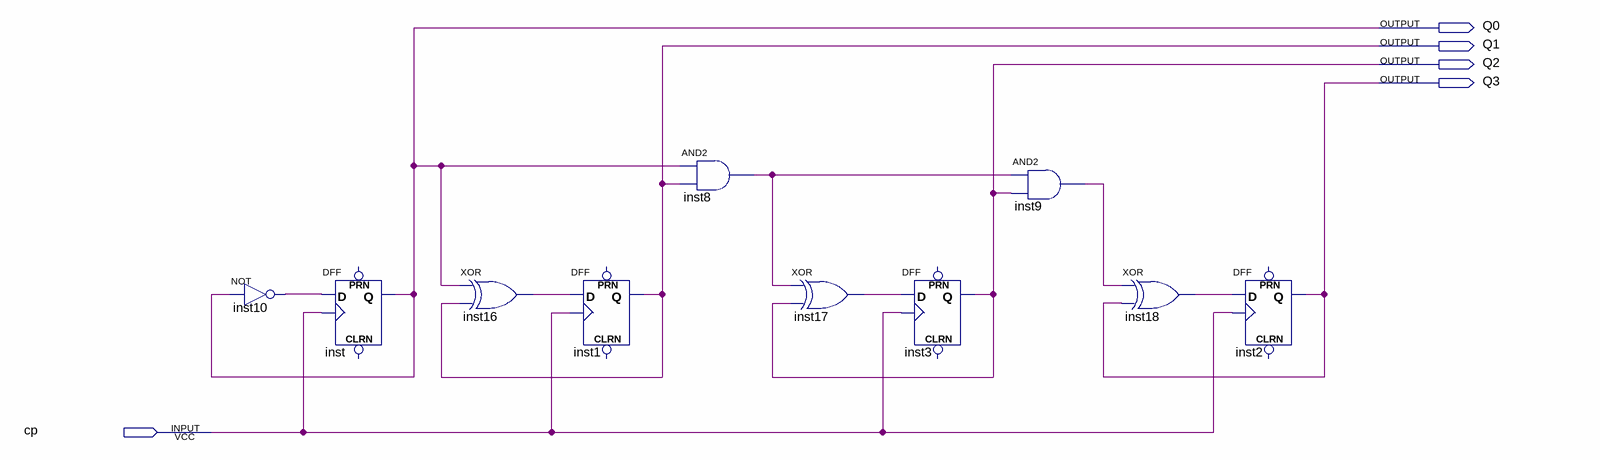
[diagram p0: schematic sheet]
// Quartus schematic 4bit_count_sync.bdf as structural Verilog: 10 symbols, 5 pins
module \4bit_count_sync  (
  input  cp,
  output Q0,
  output Q1,
  output Q2,
  output Q3
);

  wire inst8_out, inst9_out, inst10_out, inst16_out, inst17_out, inst18_out;

  not inst10 (inst10_out, Q0);
  DFF inst (.CLK(cp), .D(inst10_out), .Q(Q0));  // open: CLRN, PRN
  xor inst16 (inst16_out, Q0, Q1);
  DFF inst1 (.CLK(cp), .D(inst16_out), .Q(Q1));  // open: CLRN, PRN
  and inst8 (inst8_out, Q0, Q1);
  xor inst17 (inst17_out, inst8_out, Q2);
  DFF inst3 (.CLK(cp), .D(inst17_out), .Q(Q2));  // open: CLRN, PRN
  and inst9 (inst9_out, inst8_out, Q2);
  xor inst18 (inst18_out, inst9_out, Q3);
  DFF inst2 (.CLK(cp), .D(inst18_out), .Q(Q3));  // open: CLRN, PRN
endmodule
